# EAGLE design kuro_side (EAGLE 7.4.0)
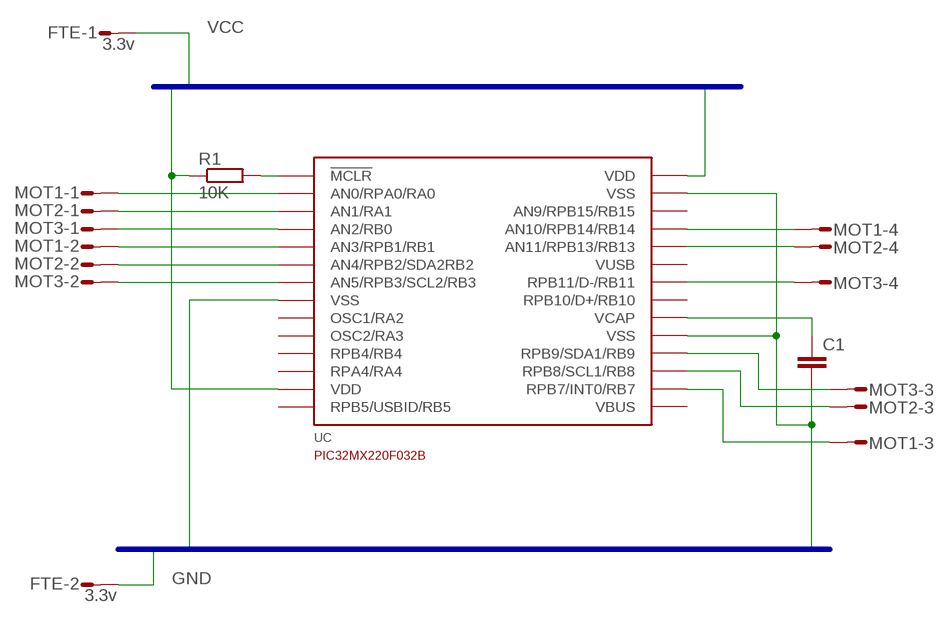
[diagram p0: schematic, sheet 1]

## Parts
C1  C2,5-3  [C2.5-3]
FTE  3.3v  S02P  [S02P]
MOT1  S04P  [S04P]
MOT2  S04P  [S04P]
MOT3  S04P  [S04P]
R1  10K  R-EU_0207/10  [0207/10]
UC  PIC32MX220F032B  [DIP28]

## Nets
GND: C1.2 FTE.2 UC.P$8(VSS) UC.P$19(VSS) UC.P$27(VSS)
N$1: R1.2 UC.P$1(!MCLR!)
N$2: C1.1 UC.P$20(VCAP)
N$3: MOT1.1 UC.P$2(AN0/RPA0/RA0)
N$4: MOT2.1 UC.P$3(AN1/RA1)
N$5: MOT3.1 UC.P$4(AN2/RB0)
N$6: MOT1.2 UC.P$5(AN3/RPB1/RB1)
N$7: MOT2.2 UC.P$6(AN4/RPB2/SDA2RB2)
N$8: MOT3.2 UC.P$7(AN5/RPB3/SCL2/RB3)
N$9: MOT3.3 UC.P$18(RPB9/SDA1/RB9)
N$10: MOT2.3 UC.P$17(RPB8/SCL1/RB8)
N$11: MOT1.3 UC.P$16(RPB7/INT0/RB7)
N$12: MOT1.4 UC.P$25(AN10/RPB14/RB14)
N$13: MOT2.4 UC.P$24(AN11/RPB13/RB13)
N$14: MOT3.4 UC.P$22(RPB11/D-/RB11)
VCC: FTE.1 R1.1 UC.P$13(VDD) UC.P$28(VDD)
Unconnected: UC.P$9(OSC1/RA2) UC.P$10(OSC2/RA3) UC.P$11(RPB4/RB4) UC.P$12(RPA4/RA4) UC.P$14(RPB5/USBID/RB5) UC.P$21(RPB10/D+/RB10) UC.P$23(VBUS) UC.P$26(AN9/RPB15/RB15)

## Buses
VCC
GND

## Power pins joined to a net without a drawn wire
VUSB: UC.P$15(VUSB)

## Library data of the parts
C1 = capacitor-wima:C: CAPACITOR naming: grid - package width
FTE = con-amp-mt:S02P: AMP MT CONNECTOR; OC_FARNELL: unknown; OC_NEWARK: unknown
MOT1-MOT3 = con-amp-mt:S04P: AMP MT CONNECTOR; OC_FARNELL: unknown; OC_NEWARK: unknown
R1 = resistor:R-EU_: RESISTOR, European symbol
UC = Minero:PIC32MX220F032B

## Board
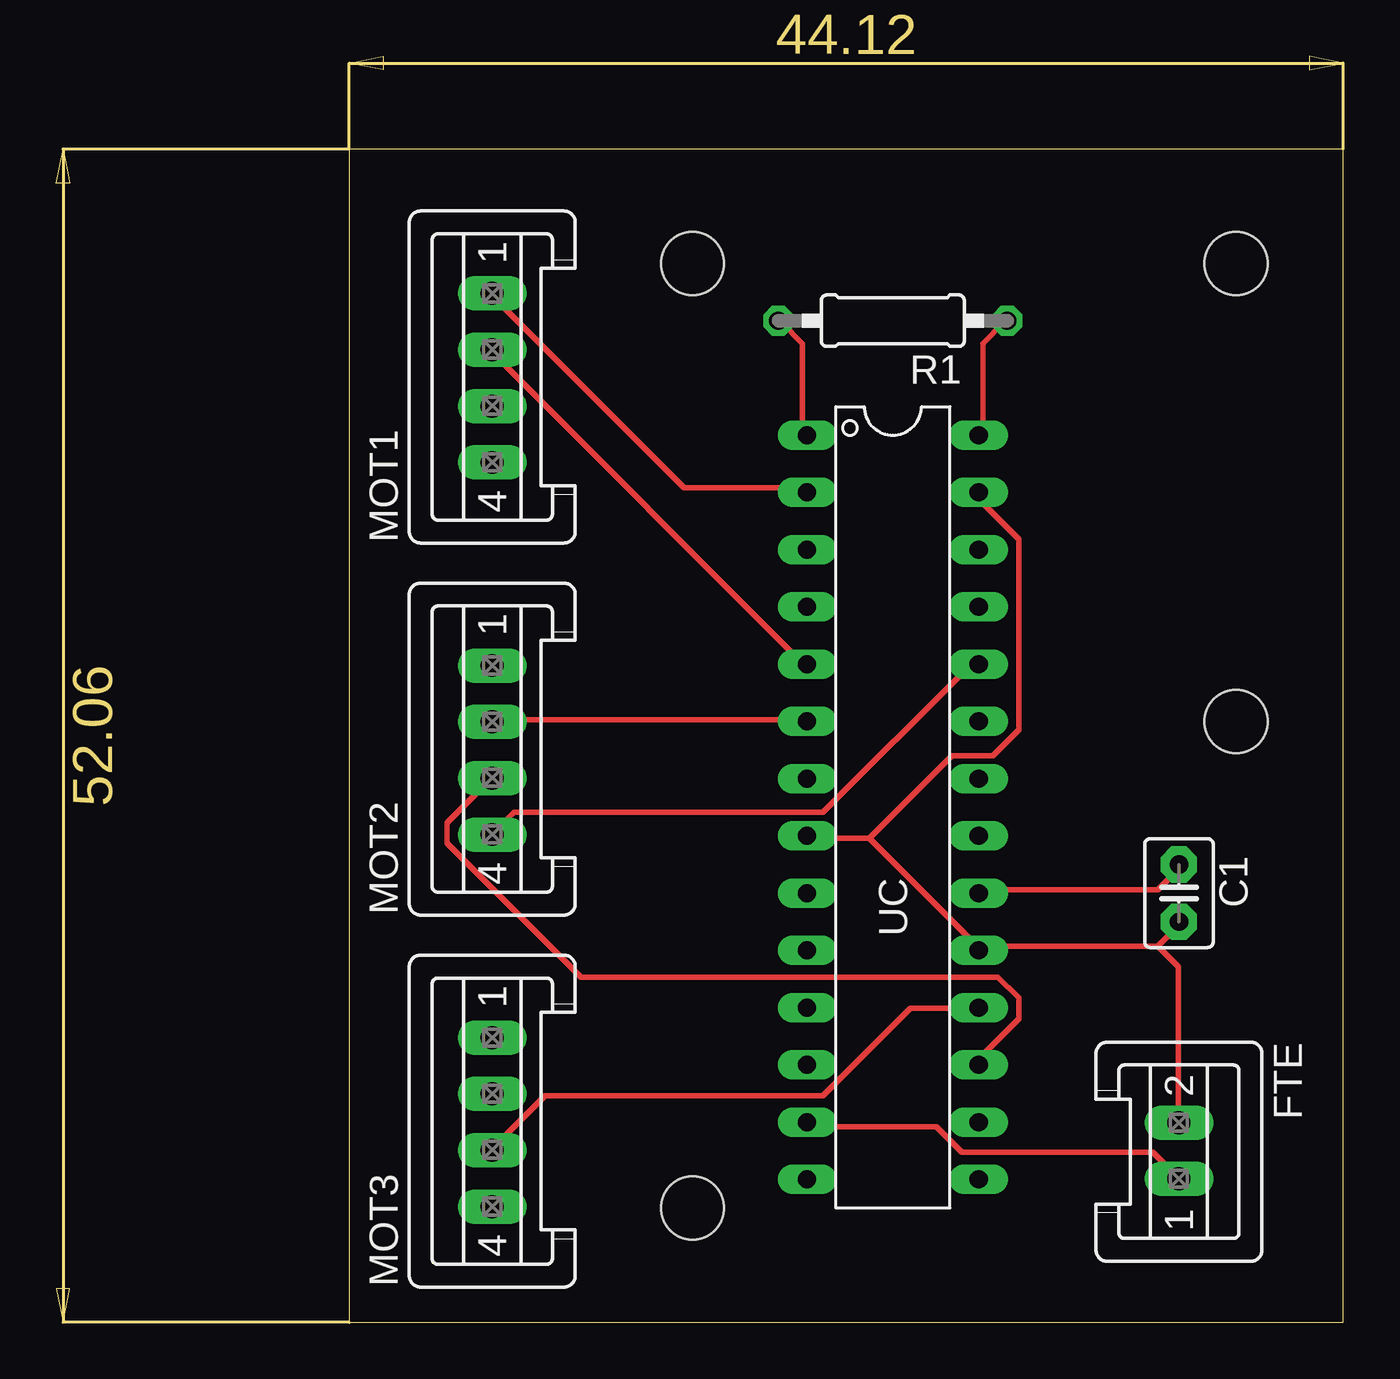
[diagram p1: board, top side]
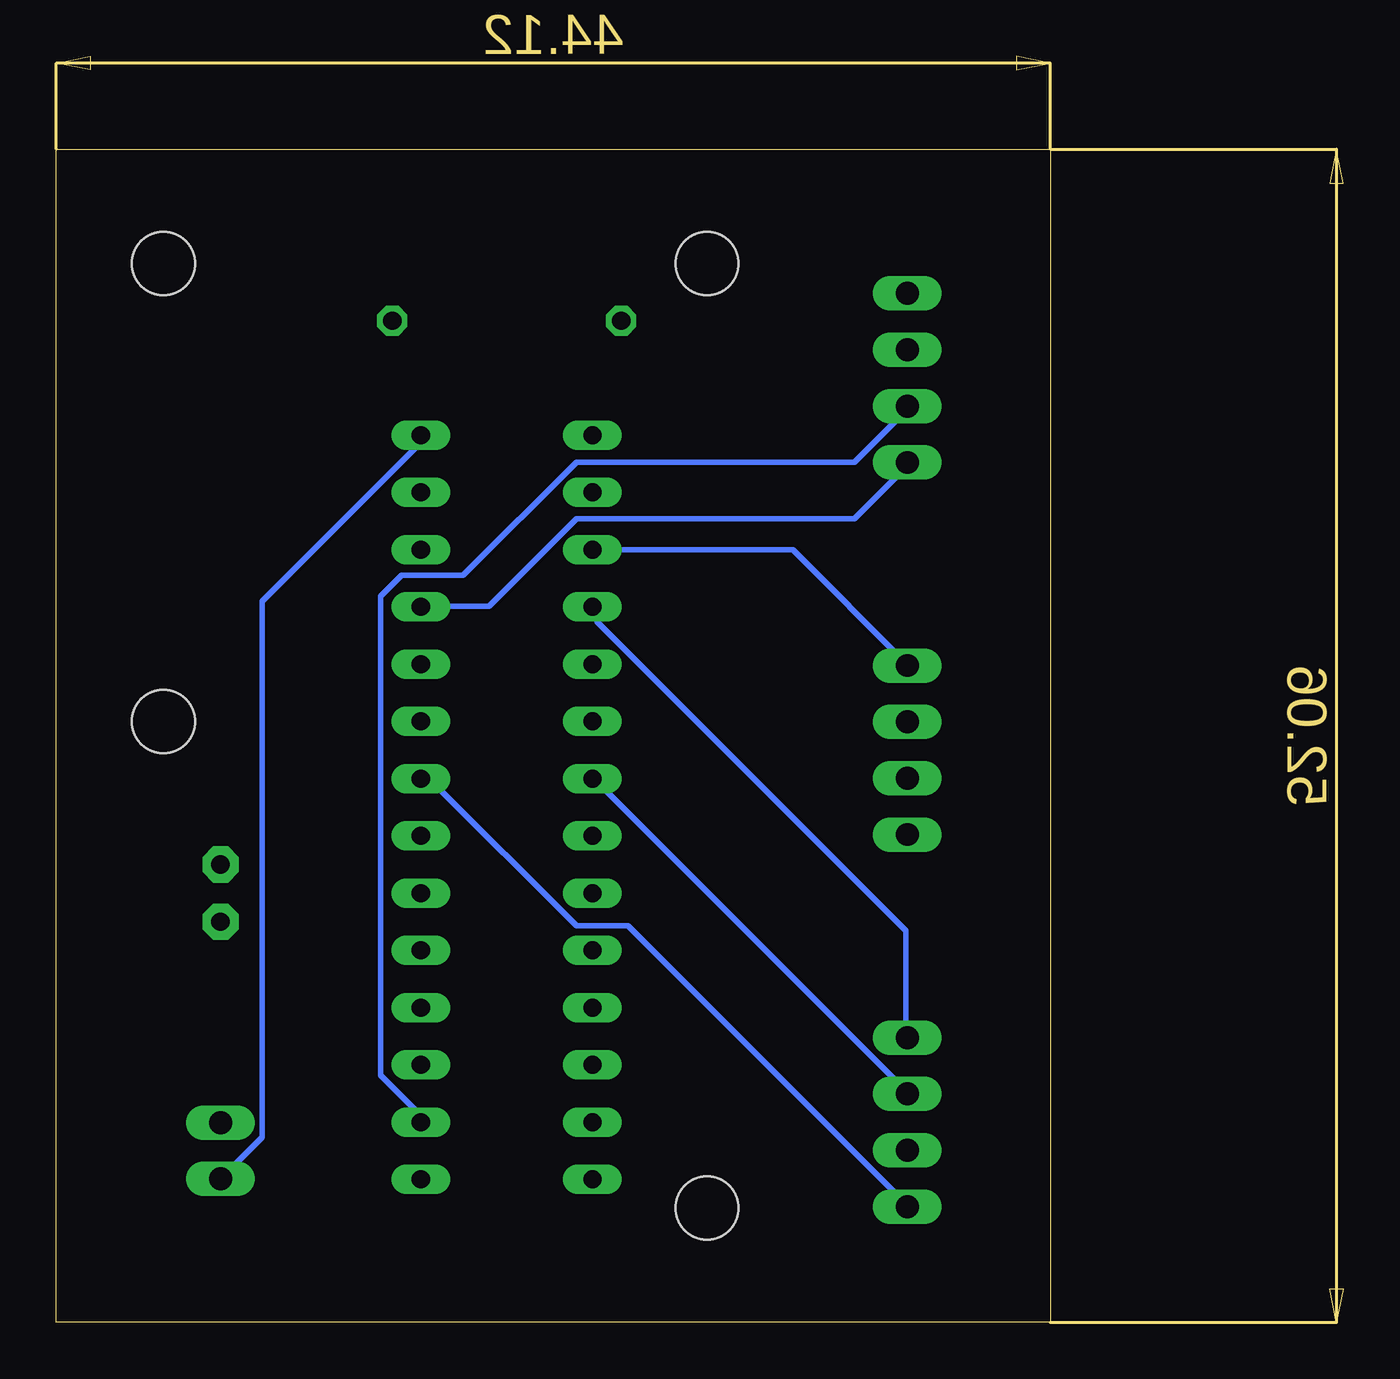
[diagram p2: board, bottom side, seen from below]

Size 44.12 x 52.06 mm. Coordinates in mm from the lower left corner, seen from the top.
Outline: 0,0 44.12,0 44.12,52.06 0,52.06 0,0
Copper layers (1*16): Top 0.035mm / dielectric 1.5mm / Bottom 0.035mm
Design rules "default": minimum track width 10mil, minimum drill 24mil, track to track 8mil, track to pad 8mil, pad to pad 8mil, via to via 8mil, smd to smd 8mil, copper to edge 40mil, drill to drill 8mil, minimum pad ring 10mil, minimum via ring 8mil, stop-mask expansion 4mil, vias tented up to drill 0mil, thermal gap 10mil
Holes 2.8 mm at 15.24,5.08 15.24,46.99 39.37,26.67 39.37,46.99

### Footprints (pad centres in the part's own frame; a part is rotated, then mirrored left to right if it is on the bottom)
C2.5-3 = drill 0.813 pad 1.6 octagon: 1 -1.27,0; 2 1.27,0
S02P = drill 1.016 long: 1 1.25,0; 2 -1.25,0
S04P = drill 1.016 long: 1 3.75,0; 2 1.25,0; 3 -1.25,0; 4 -3.75,0
0207/10 = drill 0.813 octagon: 1 -5.08,0; 2 5.08,0
DIP28 = drill 0.8 long: P$1 -3.81,15.24; P$2 -3.81,12.7; P$3 -3.81,10.16; P$4 -3.81,7.62; P$5 -3.81,5.08; P$6 -3.81,2.54; P$7 -3.81,0; P$8 -3.81,-2.54; P$9 -3.81,-5.08; P$10 -3.81,-7.62; P$11 -3.81,-10.16; P$12 -3.81,-12.7; P$13 -3.81,-15.24; P$14 -3.81,-17.78; P$15 3.81,-17.78; P$16 3.81,-15.24; P$17 3.81,-12.7; P$18 3.81,-10.16; P$19 3.81,-7.62; P$20 3.81,-5.08; P$21 3.81,-2.54; P$22 3.81,0; P$23 3.81,2.54; P$24 3.81,5.08; P$25 3.81,7.62; P$26 3.81,10.16; P$27 3.81,12.7; P$28 3.81,15.24

### Placement (x,y rotation side)
C1  36.83,19.05 270 top
FTE  36.83,7.62 270 top
MOT1  6.35,41.91 90 top
MOT2  6.35,25.4 90 top
MOT3  6.35,8.89 90 top
R1  24.13,44.45 180 top
UC  24.13,24.13 0 top

### Tracks (layer width: path | path; a pad name or v marks a point on that pad's centre or on a via)
GND
  Top 0.254: 35.89,16.69 28.12,16.69 UC.P$19 27.89,16.69 23.09,21.49 | 35.89,16.69 36.8,17.6 C1.2 | 23.09,21.49 20.34,21.49 UC.P$8 | 23.09,21.49 26.75,25.15 28.57,25.15 29.72,26.29 29.72,34.75 28.12,36.35 28.12,36.8 UC.P$27 | 35.89,16.69 36.8,15.77 36.8,8.91 FTE.2
N$1
  Top 0.254: UC.P$1 20.12,39.55 20.12,43.43 19.2,44.35 R1.2
N$2
  Top 0.254: UC.P$20 28.12,19.2 35.89,19.2 36.8,20.12 C1.1
N$3
  Top 0.254: UC.P$2 20.12,37.03 14.86,37.03 6.4,45.49 MOT1.1
N$4
  Bottom 0.254: UC.P$3 11.43,34.29 6.4,29.26 MOT2.1
N$5
  Bottom 0.254: UC.P$4 20.12,31.55 20.12,31.09 6.4,17.37 6.4,12.8 MOT3.1
N$6
  Top 0.254: UC.P$5 20.12,29.26 6.4,42.98 MOT1.2
N$7
  Top 0.254: UC.P$6 20.12,26.75 6.4,26.75 MOT2.2
N$8
  Bottom 0.254: UC.P$7 20.12,24 6.4,10.29 MOT3.2
N$9
  Top 0.254: UC.P$18 27.89,13.95 24.92,13.95 21.03,10.06 8.69,10.06 6.4,7.77 MOT3.3
N$10
  Top 0.254: UC.P$17 28.12,11.43 28.12,11.89 29.72,13.49 29.72,14.4 28.8,15.32 10.29,15.32 4.34,21.26 4.34,22.17 6.17,24 MOT2.3
N$11
  Bottom 0.254: UC.P$16 28.12,8.91 28.12,9.37 29.72,10.97 29.72,32.23 28.8,33.15 26.06,33.15 21.03,38.18 8.69,38.18 6.4,40.46 MOT1.3
N$12
  Bottom 0.254: UC.P$25 27.89,31.77 24.92,31.77 21.03,35.66 8.69,35.66 6.4,37.95 MOT1.4
N$13
  Top 0.254: UC.P$24 27.89,29.03 27.43,29.03 21.03,22.63 7.32,22.63 6.4,21.72 MOT2.4
N$14
  Bottom 0.254: UC.P$22 27.89,24 27.43,24 21.03,17.6 18.75,17.6 6.4,5.26 MOT3.4
VCC
  Top 0.254: UC.P$28 28.12,39.55 28.12,43.43 29.03,44.35 R1.1 | UC.P$13 20.34,8.69 26.06,8.69 27.2,7.54 35.66,7.54 36.8,6.4 FTE.1
  Bottom 0.254: UC.P$28 28.12,39.32 28.12,38.86 34.98,32 34.98,8.23 36.8,6.4 FTE.1